# Altium schematic sheet sensor.SchDoc
size A3
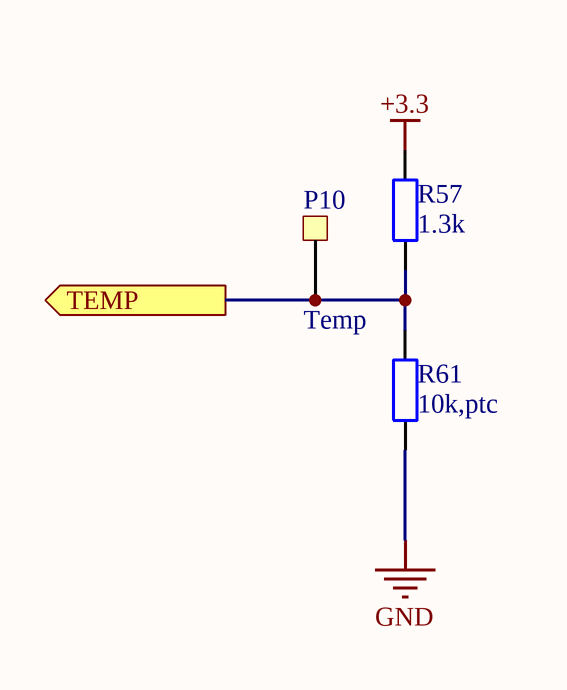
[diagram p0: sensor.SchDoc]

## Parts
P10  Temp  [Pad_3x3mm]
R57  1.3k  [RES_0603i_1608m -N]
R61  10k,ptc  [RES_0402i_1005m -N]

## Ports
TEMP (out)

## Nets
+3.3: R57.1
GND: R61.1
TEMP: P10.1 R57.2 R61.2 ; port TEMP

## Notes on the sheet
- 1
- 2
- 3
- 4
- 5
- 6
- 7
- 8
- A
- B
- C
- D
- Project:
- Date:
- Drawing number:
- Rev:
- Format:
- A3
- Drawn by:
- Laboratory:
- Page
- Sheet:
- of
- File:

## Library data of the parts
P10 = Pad: Single Pad or Testpoint
R57 = Res: Resistor
R61 = Res: temp sensor, ptc / 10k